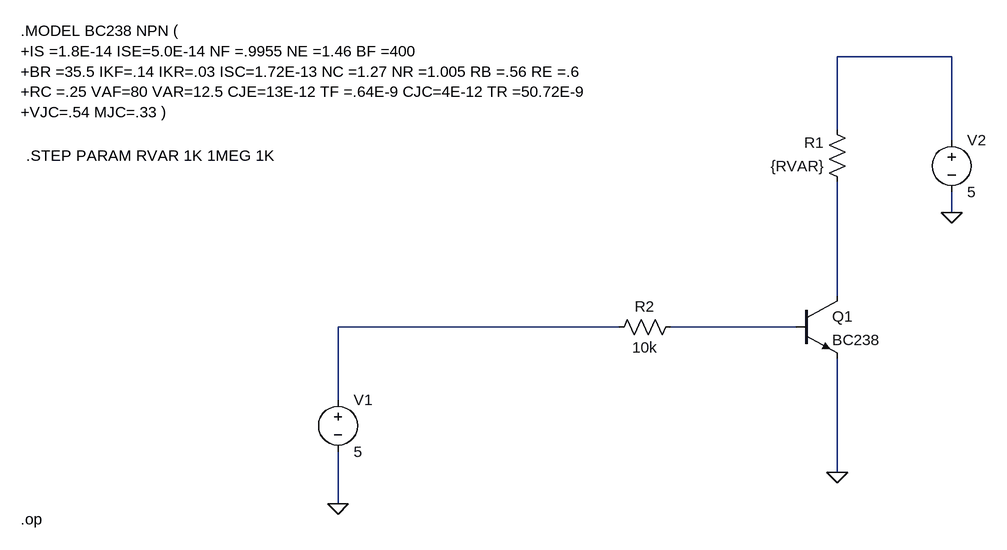
[diagram p0: schematic pot_ile_transistör_dc_analiz.asc]
pot_ile_transistör_dc_analiz.asc, the LTspice schematic file:
Version 4
SHEET 1 1080 680
WIRE 1024 -352 848 -352
WIRE 848 -240 848 -352
WIRE 1024 -224 1024 -352
WIRE 1024 -112 1024 -144
WIRE 848 16 848 -160
WIRE 512 64 80 64
WIRE 784 64 592 64
WIRE 80 176 80 64
WIRE 848 288 848 112
WIRE 80 336 80 256
FLAG 848 288 0
FLAG 80 336 0
FLAG 1024 -112 0
SYMBOL voltage 80 160 R0
WINDOW 123 0 0 Left 0
WINDOW 39 0 0 Left 0
SYMATTR InstName V1
SYMATTR Value 5
SYMBOL voltage 1024 -240 R0
WINDOW 123 0 0 Left 0
WINDOW 39 0 0 Left 0
SYMATTR InstName V2
SYMATTR Value 5
SYMBOL npn 784 16 R0
SYMATTR InstName Q1
SYMATTR Value BC238
SYMBOL res 608 48 R90
WINDOW 0 0 56 VBottom 2
WINDOW 3 32 56 VTop 2
SYMATTR InstName R2
SYMATTR Value 10k
SYMBOL res 864 -144 R180
WINDOW 0 36 76 Left 2
WINDOW 3 36 40 Left 2
SYMATTR InstName R1
SYMATTR Value {RVAR}
TEXT -408 -392 Left 2 !.MODEL BC238 NPN ( \n+IS =1.8E-14 ISE=5.0E-14 NF =.9955 NE =1.46 BF =400 \n+BR =35.5 IKF=.14 IKR=.03 ISC=1.72E-13 NC =1.27 NR =1.005 RB =.56 RE =.6 \n+RC =.25 VAF=80 VAR=12.5 CJE=13E-12 TF =.64E-9 CJC=4E-12 TR =50.72E-9 \n+VJC=.54 MJC=.33 )
TEXT -400 -200 Left 2 !.STEP PARAM RVAR 1K 1MEG 1K
TEXT -408 360 Left 2 !.op

The netlist it stands for:
* pot_ile_transistör_dc_analiz.asc
V1 N003 0 5
V2 N001 0 5
Q1 N002 N004 0 0 BC238
R2 N004 N003 10k
R1 N002 N001 {RVAR}
.model NPN NPN
.model PNP PNP
.lib standard.bjt
.MODEL BC238 NPN (
+IS =1.8E-14 ISE=5.0E-14 NF =.9955 NE =1.46 BF =400
+BR =35.5 IKF=.14 IKR=.03 ISC=1.72E-13 NC =1.27 NR =1.005 RB =.56 RE =.6
+RC =.25 VAF=80 VAR=12.5 CJE=13E-12 TF =.64E-9 CJC=4E-12 TR =50.72E-9
+VJC=.54 MJC=.33 )
.STEP PARAM RVAR 1K 1MEG 1K
.op
.backanno
.end